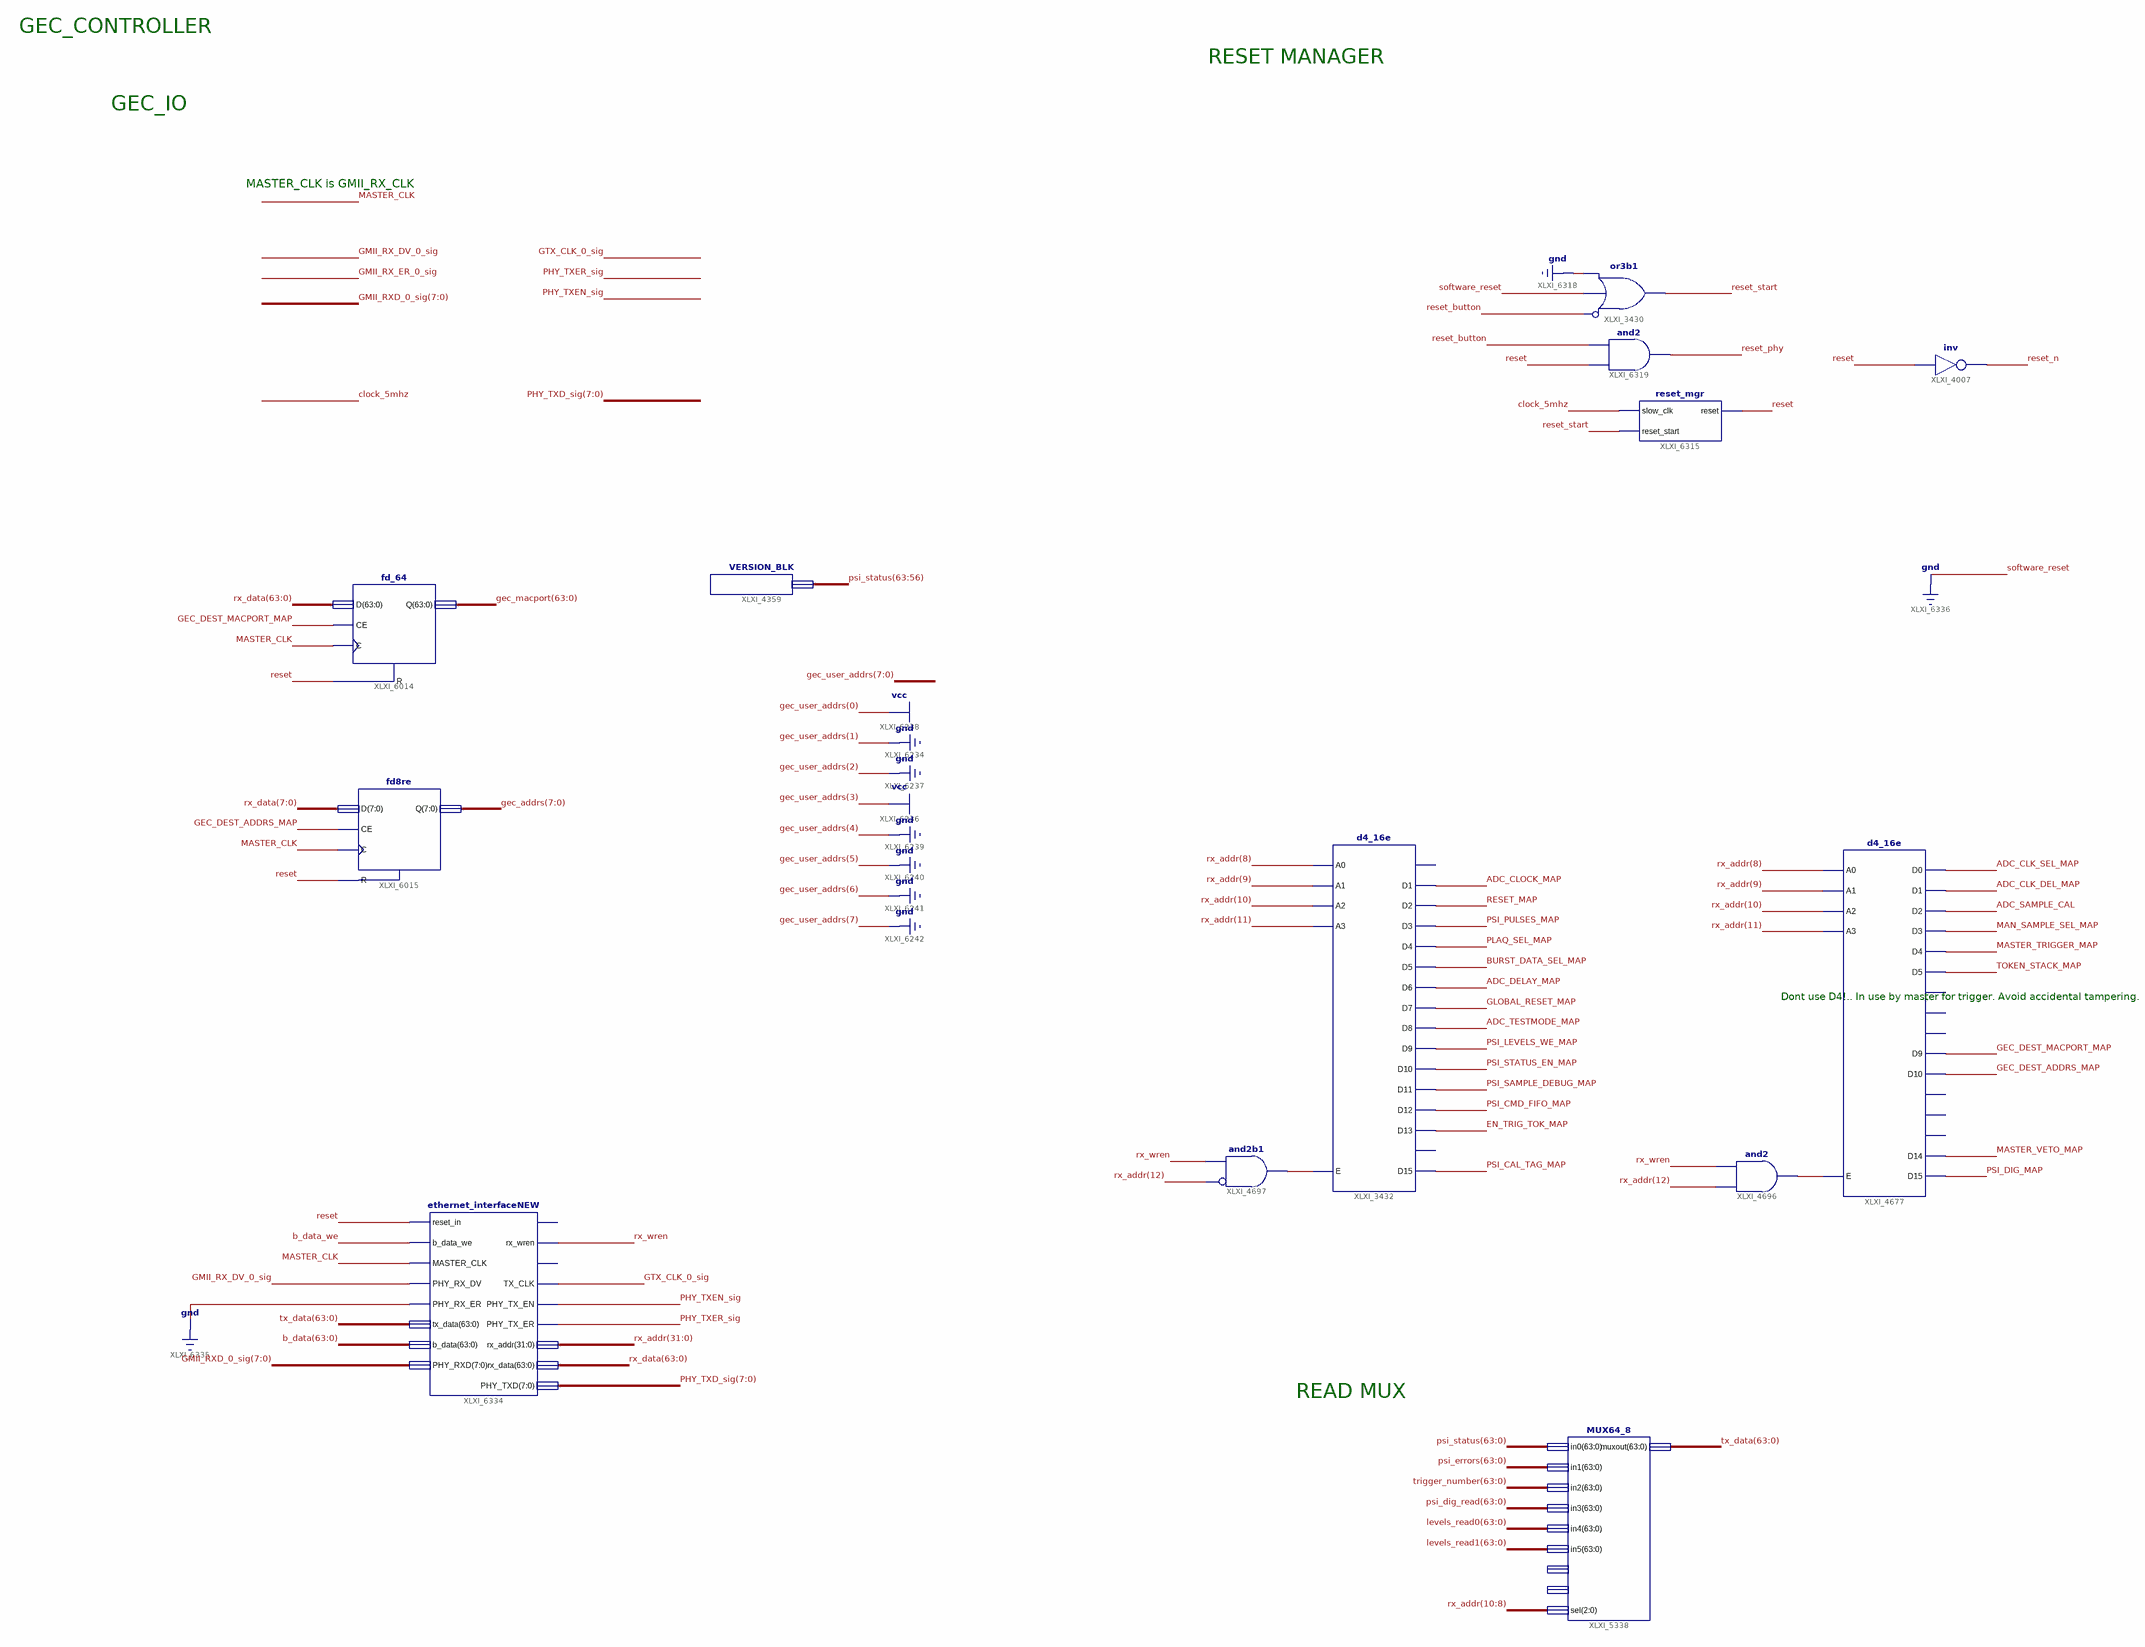
[diagram p0: schematic sheet 1]
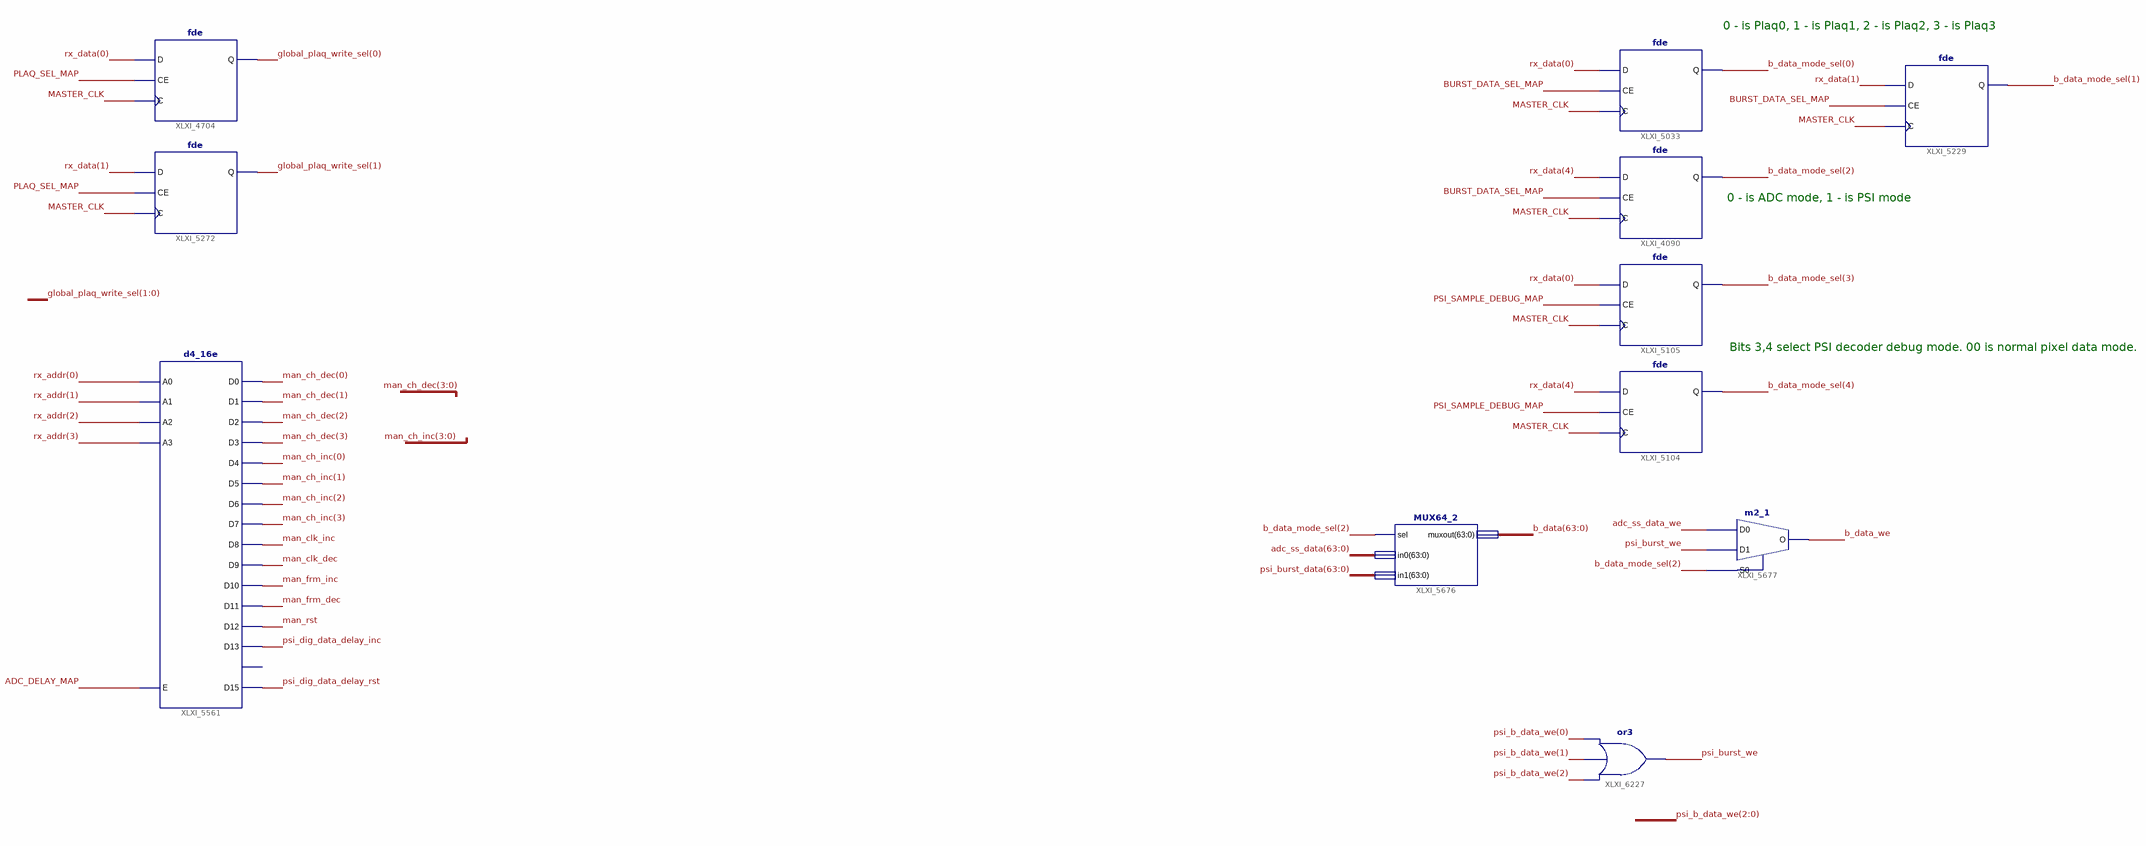
[diagram p1: schematic sheet 2]
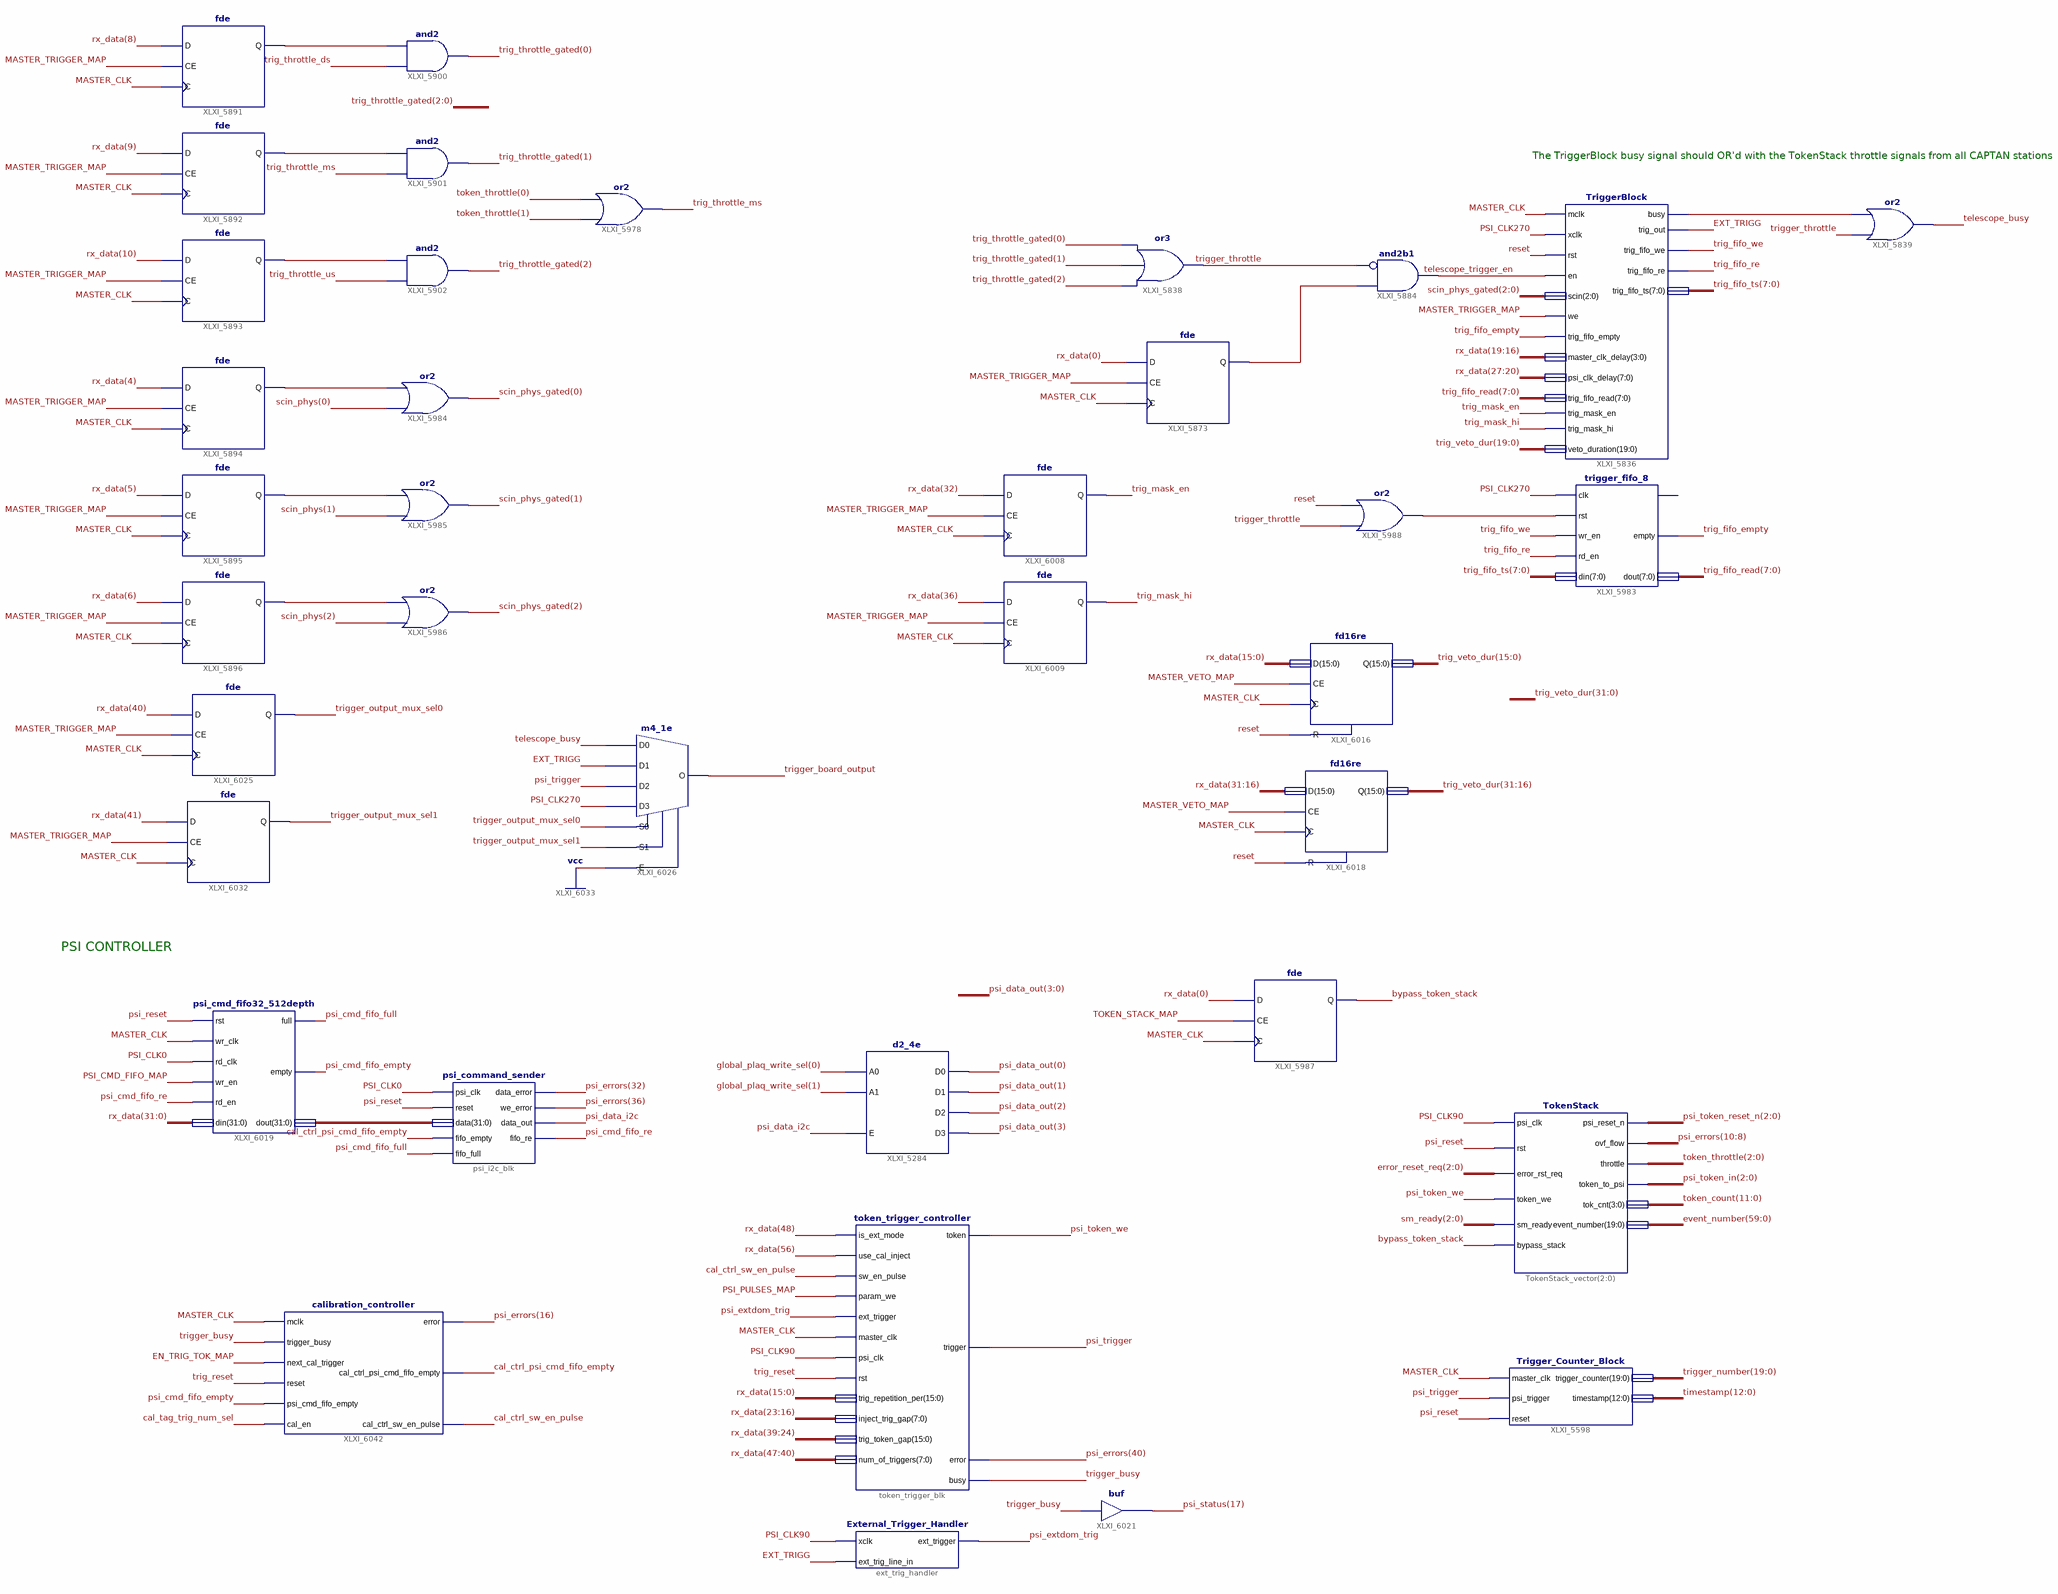
[diagram p2: schematic sheet 3]
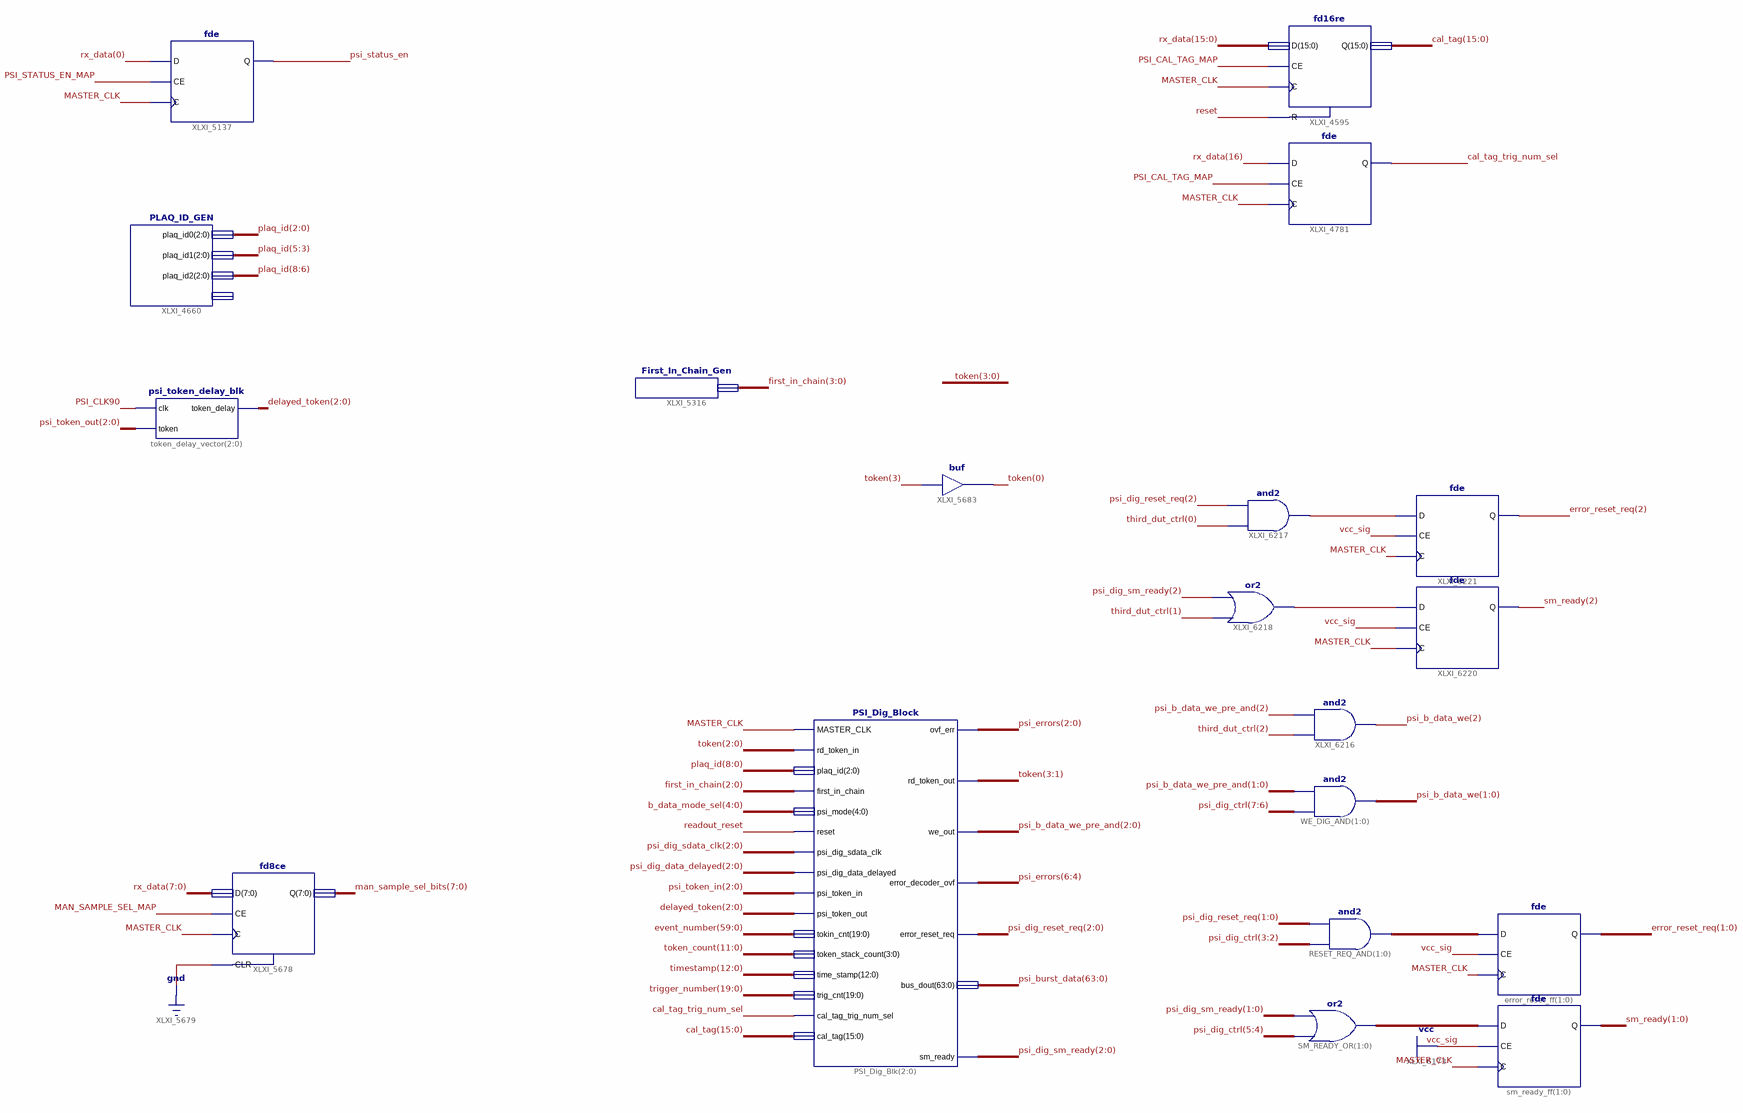
[diagram p3: schematic sheet 4]
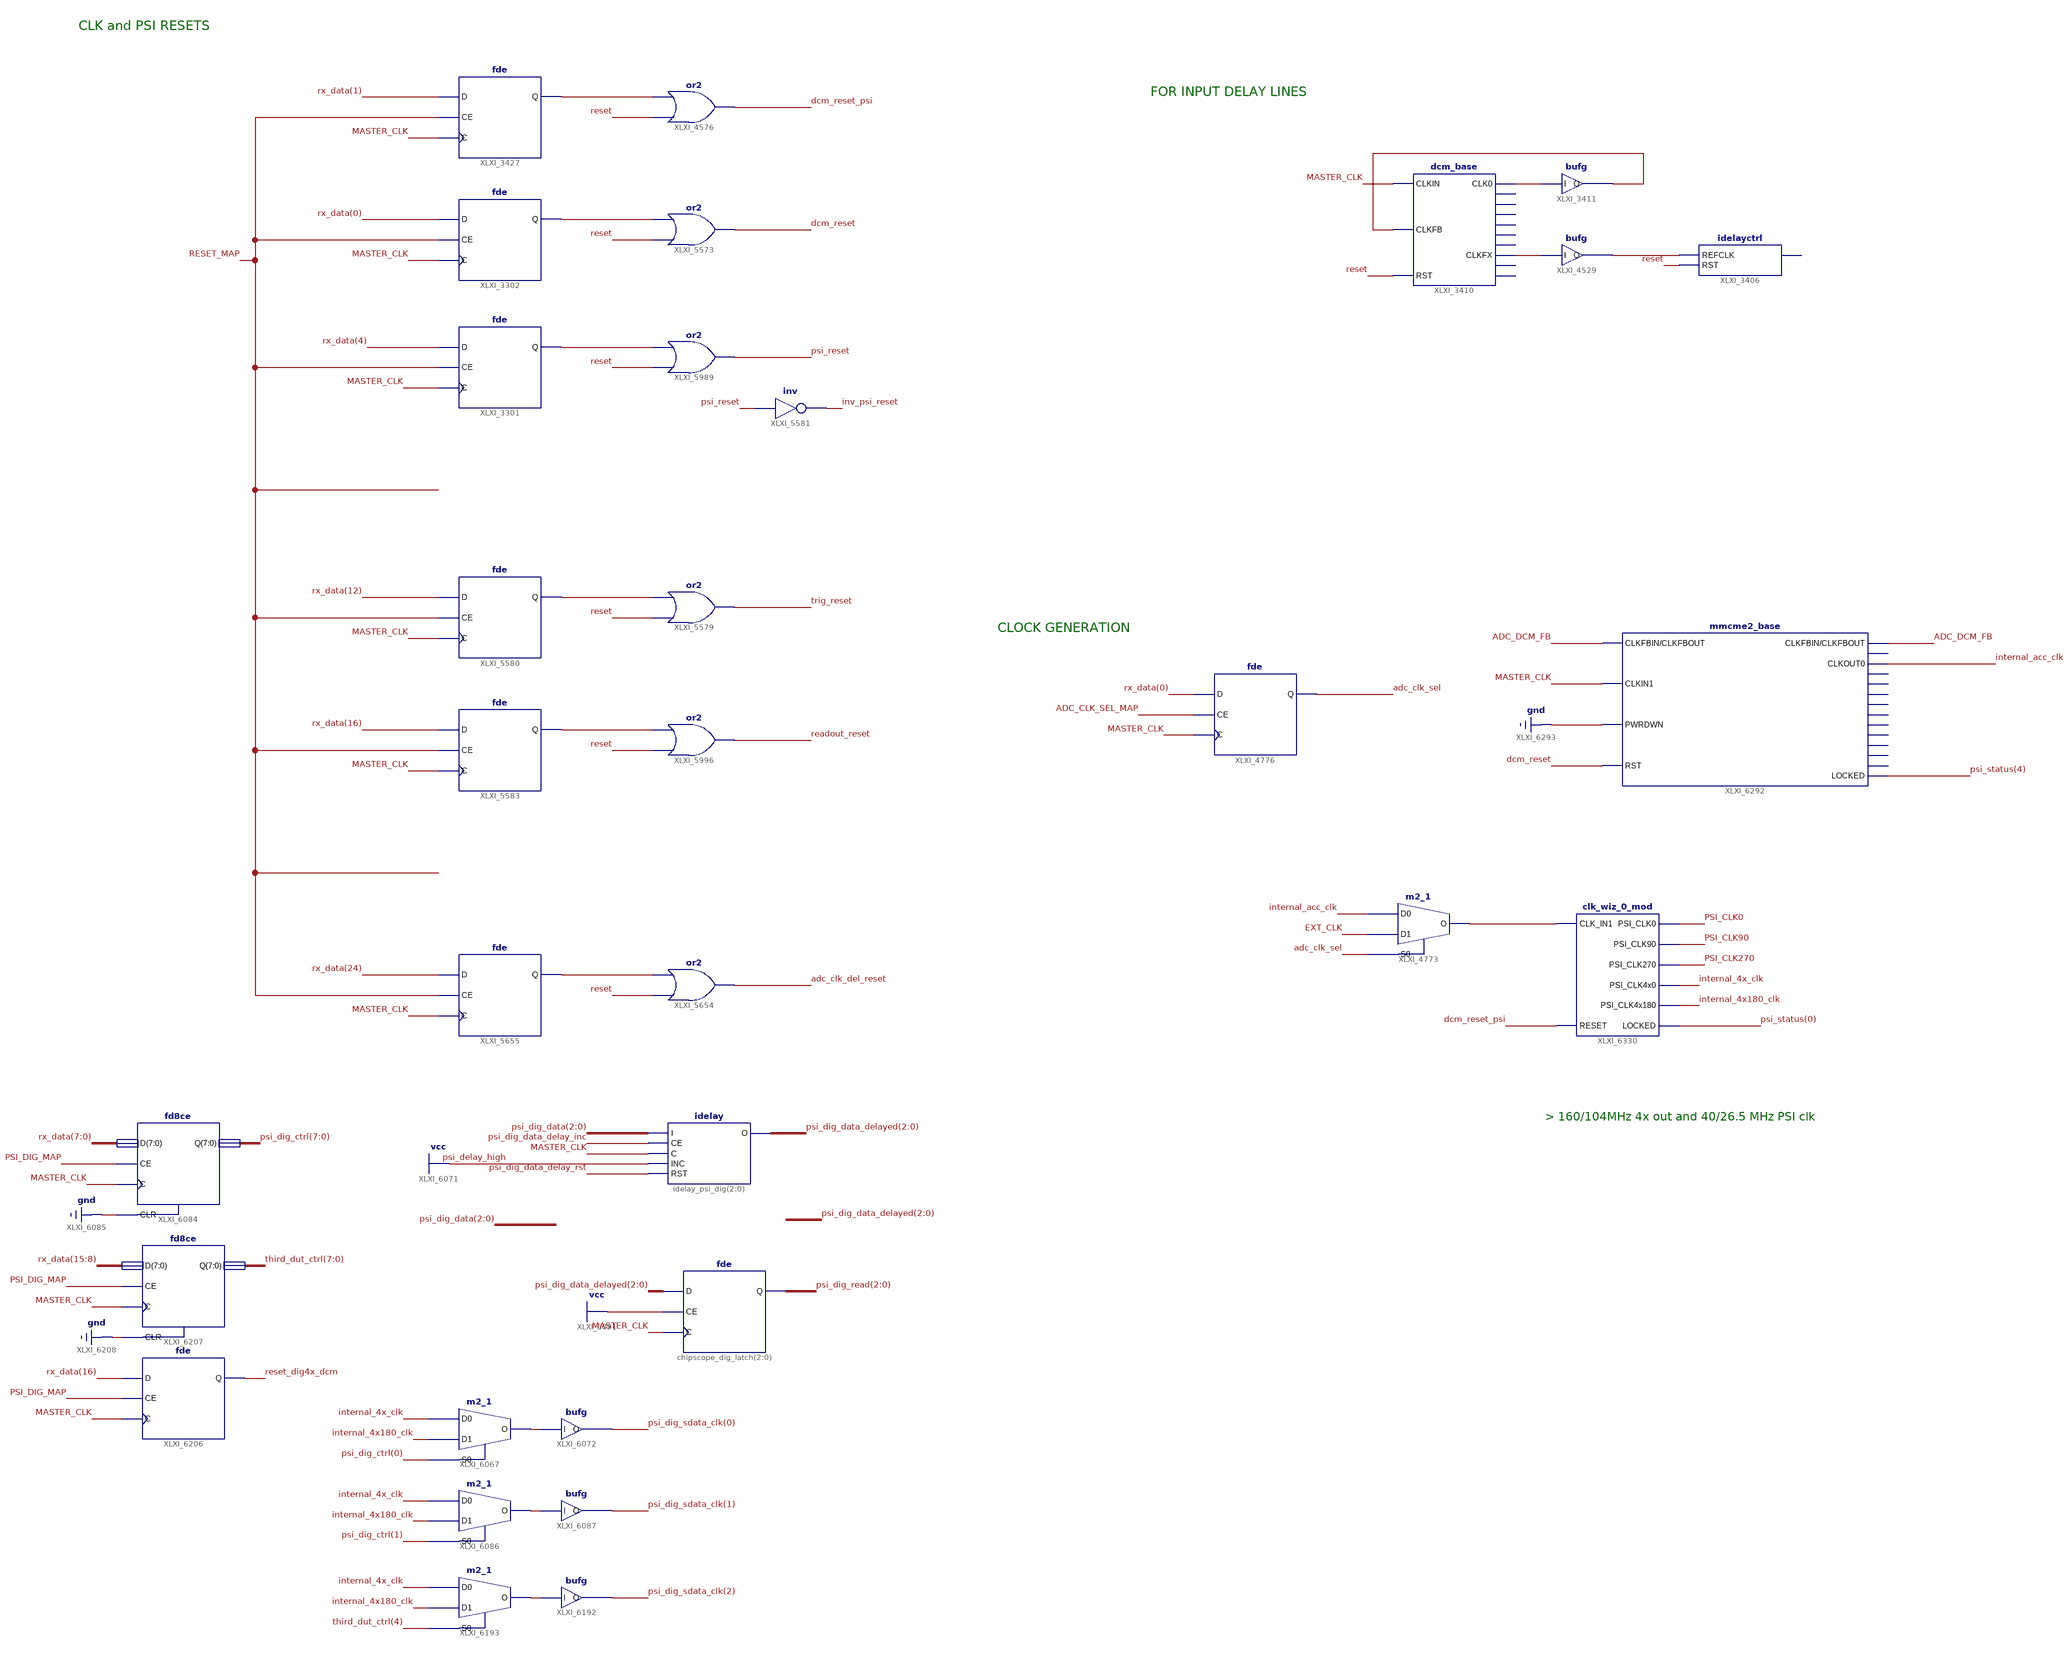
[diagram p4: schematic sheet 5]
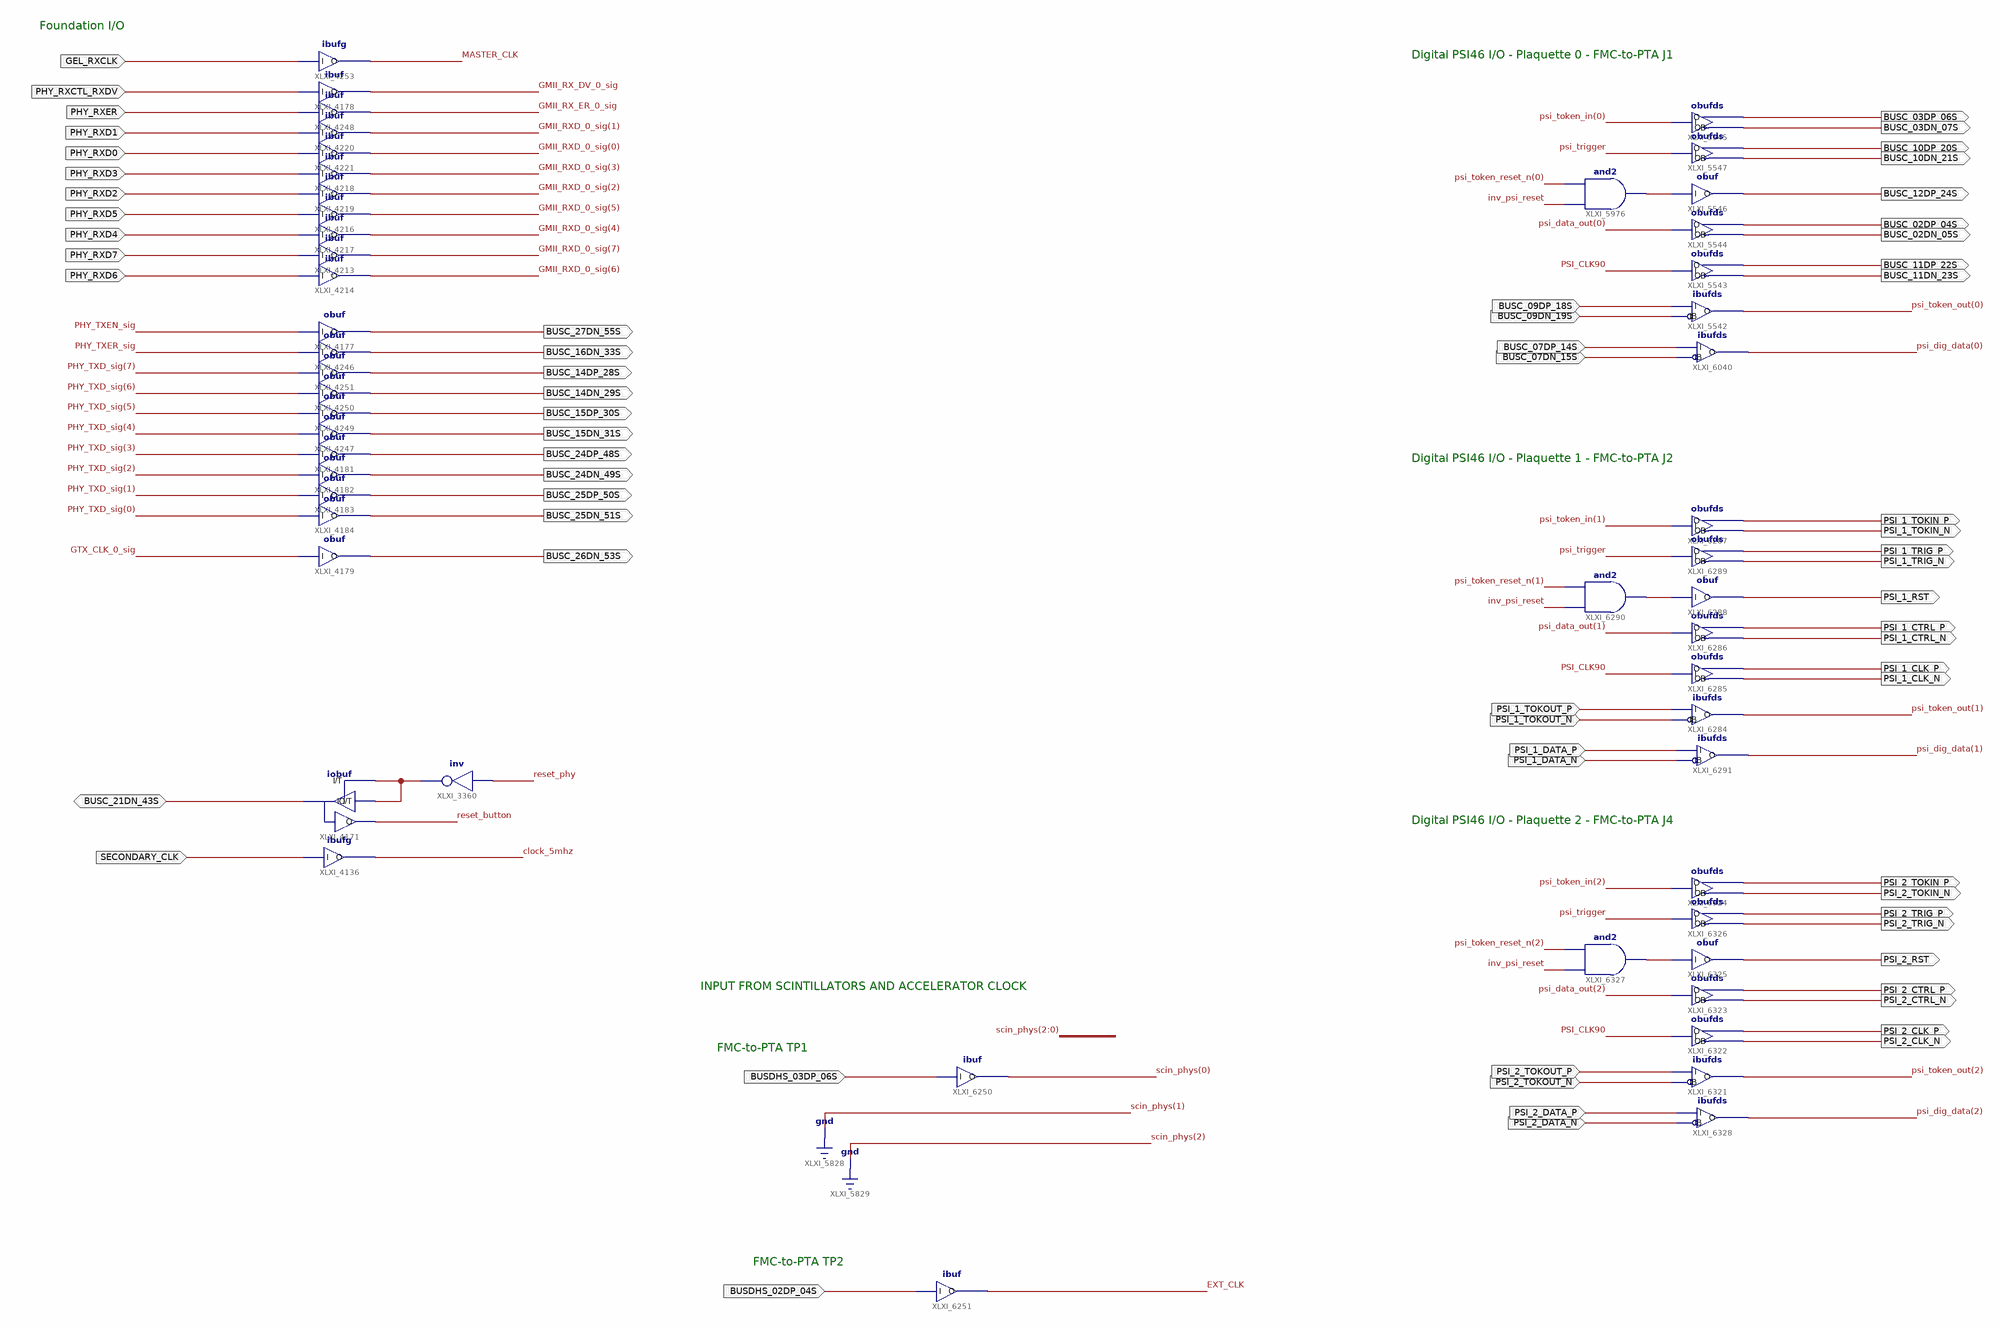
[diagram p5: schematic sheet 6]
// Xilinx ISE schematic TOP_LEVEL.sch (artix7) as structural Verilog: 163 symbols, 65 ports
module TOP_LEVEL (
  input  PHY_RXER,
  input  SECONDARY_CLK,
  input  PHY_RXD6,
  input  PHY_RXD4,
  input  PHY_RXD7,
  input  PHY_RXD5,
  input  PHY_RXD3,
  input  PHY_RXD2,
  input  PHY_RXD0,
  input  PHY_RXD1,
  input  PHY_RXCTL_RXDV,
  input  GEL_RXCLK,
  input  BUSC_09DP_18S,
  input  BUSC_09DN_19S,
  input  BUSC_07DN_15S,
  input  BUSC_07DP_14S,
  input  BUSDHS_02DP_04S,
  input  BUSDHS_03DP_06S,
  input  PSI_1_TOKOUT_P,
  input  PSI_1_TOKOUT_N,
  input  PSI_1_DATA_N,
  input  PSI_1_DATA_P,
  input  PSI_2_TOKOUT_P,
  input  PSI_2_TOKOUT_N,
  input  PSI_2_DATA_N,
  input  PSI_2_DATA_P,
  inout  BUSC_21DN_43S,
  output BUSC_25DN_51S,
  output BUSC_25DP_50S,
  output BUSC_24DN_49S,
  output BUSC_24DP_48S,
  output BUSC_15DN_31S,
  output BUSC_15DP_30S,
  output BUSC_14DN_29S,
  output BUSC_14DP_28S,
  output BUSC_16DN_33S,
  output BUSC_27DN_55S,
  output BUSC_26DN_53S,
  output BUSC_03DN_07S,
  output BUSC_02DN_05S,
  output BUSC_11DP_22S,
  output BUSC_11DN_23S,
  output BUSC_02DP_04S,
  output BUSC_12DP_24S,
  output BUSC_10DN_21S,
  output BUSC_03DP_06S,
  output BUSC_10DP_20S,
  output PSI_1_CLK_P,
  output PSI_1_CLK_N,
  output PSI_1_CTRL_P,
  output PSI_1_CTRL_N,
  output PSI_1_TOKIN_P,
  output PSI_1_TOKIN_N,
  output PSI_1_RST,
  output PSI_1_TRIG_P,
  output PSI_1_TRIG_N,
  output PSI_2_CLK_P,
  output PSI_2_CLK_N,
  output PSI_2_CTRL_P,
  output PSI_2_CTRL_N,
  output PSI_2_TOKIN_P,
  output PSI_2_TOKIN_N,
  output PSI_2_RST,
  output PSI_2_TRIG_P,
  output PSI_2_TRIG_N
);

  wire ADC_CLK_DEL_MAP, adc_clk_del_reset, adc_clk_sel, ADC_CLK_SEL_MAP, ADC_CLOCK_MAP, ADC_DCM_FB,
       ADC_DELAY_MAP, ADC_SAMPLE_CAL, adc_ss_data_we, ADC_TESTMODE_MAP, b_data_we, BURST_DATA_SEL_MAP,
       bypass_token_stack, cal_ctrl_psi_cmd_fifo_empty, cal_ctrl_sw_en_pulse, cal_tag_trig_num_sel,
       clock_5mhz, dcm_reset, dcm_reset_psi, EN_TRIG_TOK_MAP, EXT_CLK, EXT_TRIGG, GEC_DEST_ADDRS_MAP,
       GEC_DEST_MACPORT_MAP, GLOBAL_RESET_MAP, GMII_RX_DV_0_sig, GMII_RX_ER_0_sig, GTX_CLK_0_sig,
       internal_4x180_clk, internal_4x_clk, internal_acc_clk, inv_psi_reset, man_clk_dec, man_clk_inc,
       man_frm_dec, man_frm_inc, man_rst, MAN_SAMPLE_SEL_MAP, MASTER_CLK, MASTER_TRIGGER_MAP,
       MASTER_VETO_MAP, PHY_TXEN_sig, PHY_TXER_sig, PLAQ_SEL_MAP, psi_burst_we, PSI_CAL_TAG_MAP, PSI_CLK0,
       PSI_CLK90, PSI_CLK270, psi_cmd_fifo_empty, psi_cmd_fifo_full, PSI_CMD_FIFO_MAP, psi_cmd_fifo_re,
       psi_data_i2c, psi_dig_data_delay_inc, psi_dig_data_delay_rst, PSI_DIG_MAP, psi_extdom_trig,
       PSI_LEVELS_WE_MAP, PSI_PULSES_MAP, psi_reset, PSI_SAMPLE_DEBUG_MAP, psi_status_en, PSI_STATUS_EN_MAP,
       psi_token_we, psi_trigger, readout_reset, reset, reset_button, reset_dig4x_dcm, RESET_MAP, reset_n,
       reset_phy, reset_start, rx_wren, telescope_busy, telescope_trigger_en, TOKEN_STACK_MAP,
       trig_fifo_empty, trig_fifo_re, trig_fifo_we, trig_mask_en, trig_mask_hi, trig_reset, trig_throttle_ds,
       trig_throttle_ms, trig_throttle_us, trigger_board_output, trigger_busy, trigger_output_mux_sel0,
       trigger_output_mux_sel1, trigger_throttle, XLXN_12023, XLXN_12220, XLXN_12229, XLXN_12257, XLXN_12617,
       XLXN_15064, XLXN_15755, XLXN_15849, XLXN_17193, XLXN_17196, XLXN_17199, XLXN_17233, XLXN_17239,
       XLXN_17430, XLXN_17722, XLXN_17849, XLXN_17913, XLXN_17914, XLXN_17915, XLXN_17999, XLXN_18000,
       XLXN_18001, XLXN_18123, XLXN_18128, XLXN_18355, XLXN_18372, XLXN_18597, XLXN_18694, XLXN_18695,
       XLXN_18733, XLXN_18828;
  wire [0:0] scin_phys;
  wire [1:0] global_plaq_write_sel, XLXN_18540, XLXN_18546;
  wire [2:0] delayed_token, error_reset_req, psi_b_data_we, psi_b_data_we_pre_and, psi_dig_data,
       psi_dig_data_delayed, psi_dig_reset_req, psi_dig_sdata_clk, psi_dig_sm_ready, psi_token_in,
       psi_token_out, psi_token_reset_n, scin_phys_gated, sm_ready, token_throttle, trig_throttle_gated;
  wire [3:0] first_in_chain, man_ch_dec, man_ch_inc, psi_data_out, token;
  wire [4:0] b_data_mode_sel;
  wire [7:0] gec_addrs, GMII_RXD_0_sig, man_sample_sel_bits, PHY_TXD_sig, psi_dig_ctrl, third_dut_ctrl,
       trig_fifo_read, trig_fifo_ts;
  wire [8:0] plaq_id;
  wire [11:0] token_count;
  wire [12:0] timestamp;
  wire [15:0] cal_tag;
  wire [31:0] rx_addr, trig_veto_dur, XLXN_16082;
  wire [59:0] event_number;
  wire [63:0] adc_ss_data, b_data, gec_macport, levels_read0, levels_read1, psi_burst_data, psi_dig_read,
       psi_errors, psi_status, rx_data, trigger_number, tx_data;

  ibuf XLXI_4248 (.I(PHY_RXER), .O(GMII_RX_ER_0_sig));
  ibufg XLXI_4136 (.I(SECONDARY_CLK), .O(clock_5mhz));
  obuf XLXI_4181 (.I(PHY_TXD_sig[3]), .O(BUSC_24DP_48S));
  obuf XLXI_4182 (.I(PHY_TXD_sig[2]), .O(BUSC_24DN_49S));
  obuf XLXI_4183 (.I(PHY_TXD_sig[1]), .O(BUSC_25DP_50S));
  obuf XLXI_4184 (.I(PHY_TXD_sig[0]), .O(BUSC_25DN_51S));
  obuf XLXI_4247 (.I(PHY_TXD_sig[4]), .O(BUSC_15DN_31S));
  obuf XLXI_4249 (.I(PHY_TXD_sig[5]), .O(BUSC_15DP_30S));
  obuf XLXI_4250 (.I(PHY_TXD_sig[6]), .O(BUSC_14DN_29S));
  obuf XLXI_4251 (.I(PHY_TXD_sig[7]), .O(BUSC_14DP_28S));
  obuf XLXI_4246 (.I(PHY_TXER_sig), .O(BUSC_16DN_33S));
  ibuf XLXI_4213 (.I(PHY_RXD7), .O(GMII_RXD_0_sig[7]));
  ibuf XLXI_4214 (.I(PHY_RXD6), .O(GMII_RXD_0_sig[6]));
  ibuf XLXI_4216 (.I(PHY_RXD5), .O(GMII_RXD_0_sig[5]));
  ibuf XLXI_4217 (.I(PHY_RXD4), .O(GMII_RXD_0_sig[4]));
  ibuf XLXI_4218 (.I(PHY_RXD3), .O(GMII_RXD_0_sig[3]));
  ibuf XLXI_4219 (.I(PHY_RXD2), .O(GMII_RXD_0_sig[2]));
  ibuf XLXI_4220 (.I(PHY_RXD1), .O(GMII_RXD_0_sig[1]));
  ibuf XLXI_4221 (.I(PHY_RXD0), .O(GMII_RXD_0_sig[0]));
  obuf XLXI_4177 (.I(PHY_TXEN_sig), .O(BUSC_27DN_55S));
  ibuf XLXI_4178 (.I(PHY_RXCTL_RXDV), .O(GMII_RX_DV_0_sig));
  ibufg XLXI_4253 (.I(GEL_RXCLK), .O(MASTER_CLK));
  obuf XLXI_4179 (.I(GTX_CLK_0_sig), .O(BUSC_26DN_53S));
  or XLXI_3430 (reset_start, ~reset_button, 1'b0, 1'b0);  // or3b1
  d4_16e XLXI_3432 (
    .A0(rx_addr[8]), .A1(rx_addr[9]), .A2(rx_addr[10]), .A3(rx_addr[11]), .E(XLXN_12617), .D1(ADC_CLOCK_MAP),
    .D10(PSI_STATUS_EN_MAP), .D11(PSI_SAMPLE_DEBUG_MAP), .D12(PSI_CMD_FIFO_MAP), .D13(EN_TRIG_TOK_MAP),
    .D15(PSI_CAL_TAG_MAP), .D2(RESET_MAP), .D3(PSI_PULSES_MAP), .D4(PLAQ_SEL_MAP), .D5(BURST_DATA_SEL_MAP),
    .D6(ADC_DELAY_MAP), .D7(GLOBAL_RESET_MAP), .D8(ADC_TESTMODE_MAP), .D9(PSI_LEVELS_WE_MAP));  // open: D0, D14
  and XLXI_4697 (XLXN_12617, ~rx_addr[12], rx_wren);  // and2b1
  fde XLXI_3302 (.C(MASTER_CLK), .CE(RESET_MAP), .D(rx_data[0]), .Q(XLXN_17196));
  fde XLXI_3427 (.C(MASTER_CLK), .CE(RESET_MAP), .D(rx_data[1]), .Q(XLXN_17193));
  fde XLXI_3301 (.C(MASTER_CLK), .CE(RESET_MAP), .D(rx_data[4]), .Q(XLXN_17199));
  and XLXI_4696 (XLXN_15755, rx_addr[12], rx_wren);
  d4_16e XLXI_4677 (
    .A0(rx_addr[8]), .A1(rx_addr[9]), .A2(rx_addr[10]), .A3(rx_addr[11]), .E(XLXN_15755),
    .D0(ADC_CLK_SEL_MAP), .D1(ADC_CLK_DEL_MAP), .D10(GEC_DEST_ADDRS_MAP), .D14(MASTER_VETO_MAP),
    .D15(PSI_DIG_MAP), .D2(ADC_SAMPLE_CAL), .D3(MAN_SAMPLE_SEL_MAP), .D4(MASTER_TRIGGER_MAP),
    .D5(TOKEN_STACK_MAP), .D9(GEC_DEST_MACPORT_MAP));  // open: D11, D12, D13, D6, D7, D8
  fde XLXI_4090 (.C(MASTER_CLK), .CE(BURST_DATA_SEL_MAP), .D(rx_data[4]), .Q(b_data_mode_sel[2]));
  fde XLXI_5033 (.C(MASTER_CLK), .CE(BURST_DATA_SEL_MAP), .D(rx_data[0]), .Q(b_data_mode_sel[0]));
  fde XLXI_5104 (.C(MASTER_CLK), .CE(PSI_SAMPLE_DEBUG_MAP), .D(rx_data[4]), .Q(b_data_mode_sel[4]));
  fde XLXI_5105 (.C(MASTER_CLK), .CE(PSI_SAMPLE_DEBUG_MAP), .D(rx_data[0]), .Q(b_data_mode_sel[3]));
  fde XLXI_5229 (.C(MASTER_CLK), .CE(BURST_DATA_SEL_MAP), .D(rx_data[1]), .Q(b_data_mode_sel[1]));
  fde XLXI_5272 (.C(MASTER_CLK), .CE(PLAQ_SEL_MAP), .D(rx_data[1]), .Q(global_plaq_write_sel[1]));
  fde XLXI_4704 (.C(MASTER_CLK), .CE(PLAQ_SEL_MAP), .D(rx_data[0]), .Q(global_plaq_write_sel[0]));
  PLAQ_ID_GEN XLXI_4660 (.plaq_id0(plaq_id[2:0]), .plaq_id1(plaq_id[5:3]), .plaq_id2(plaq_id[8:6]));  // open: plaq_id3
  fde XLXI_5137 (.C(MASTER_CLK), .CE(PSI_STATUS_EN_MAP), .D(rx_data[0]), .Q(psi_status_en));
  psi_token_delay_blk token_delay_vector[2:0] (.clk(PSI_CLK90), .token(psi_token_out), .token_delay(delayed_token));
  First_In_Chain_Gen XLXI_5316 (.first_in_chain(first_in_chain));
  fd16re XLXI_4595 (.C(MASTER_CLK), .CE(PSI_CAL_TAG_MAP), .D(rx_data[15:0]), .R(reset), .Q(cal_tag));
  fde XLXI_4781 (.C(MASTER_CLK), .CE(PSI_CAL_TAG_MAP), .D(rx_data[16]), .Q(cal_tag_trig_num_sel));
  MUX64_8 XLXI_5338 (
    .in0(psi_status), .in1(psi_errors), .in2(trigger_number), .in3(psi_dig_read), .in4(levels_read0),
    .in5(levels_read1), .sel(rx_addr[10:8]), .muxout(tx_data));  // open: in6, in7
  d4_16e XLXI_5561 (
    .A0(rx_addr[0]), .A1(rx_addr[1]), .A2(rx_addr[2]), .A3(rx_addr[3]), .E(ADC_DELAY_MAP),
    .D0(man_ch_dec[0]), .D1(man_ch_dec[1]), .D10(man_frm_inc), .D11(man_frm_dec), .D12(man_rst),
    .D13(psi_dig_data_delay_inc), .D15(psi_dig_data_delay_rst), .D2(man_ch_dec[2]), .D3(man_ch_dec[3]),
    .D4(man_ch_inc[0]), .D5(man_ch_inc[1]), .D6(man_ch_inc[2]), .D7(man_ch_inc[3]), .D8(man_clk_inc),
    .D9(man_clk_dec));  // open: D14
  psi_command_sender psi_i2c_blk (
    .psi_clk(PSI_CLK0), .reset(psi_reset), .fifo_empty(cal_ctrl_psi_cmd_fifo_empty),
    .fifo_full(psi_cmd_fifo_full), .data(XLXN_16082), .fifo_re(psi_cmd_fifo_re), .data_error(psi_errors[32]),
    .we_error(psi_errors[36]), .data_out(psi_data_i2c));
  d2_4e XLXI_5284 (
    .A0(global_plaq_write_sel[0]), .A1(global_plaq_write_sel[1]), .E(psi_data_i2c), .D0(psi_data_out[0]),
    .D1(psi_data_out[1]), .D2(psi_data_out[2]), .D3(psi_data_out[3]));
  token_trigger_controller token_trigger_blk (
    .is_ext_mode(rx_data[48]), .use_cal_inject(rx_data[56]), .sw_en_pulse(cal_ctrl_sw_en_pulse),
    .param_we(PSI_PULSES_MAP), .ext_trigger(psi_extdom_trig), .master_clk(MASTER_CLK), .psi_clk(PSI_CLK90),
    .rst(trig_reset), .trig_repetition_per(rx_data[15:0]), .inject_trig_gap(rx_data[23:16]),
    .trig_token_gap(rx_data[39:24]), .num_of_triggers(rx_data[47:40]), .token(psi_token_we),
    .trigger(psi_trigger), .error(psi_errors[40]), .busy(trigger_busy));
  or XLXI_4576 (dcm_reset_psi, reset, XLXN_17193);
  or XLXI_5573 (dcm_reset, reset, XLXN_17196);
  or XLXI_5579 (trig_reset, reset, XLXN_17233);
  fde XLXI_5580 (.C(MASTER_CLK), .CE(RESET_MAP), .D(rx_data[12]), .Q(XLXN_17233));
  not XLXI_5581 (inv_psi_reset, psi_reset);
  fde XLXI_5583 (.C(MASTER_CLK), .CE(RESET_MAP), .D(rx_data[16]), .Q(XLXN_17239));
  or XLXI_5654 (adc_clk_del_reset, reset, XLXN_17430);
  fde XLXI_5655 (.C(MASTER_CLK), .CE(RESET_MAP), .D(rx_data[24]), .Q(XLXN_17430));
  MUX64_2 XLXI_5676 (.sel(b_data_mode_sel[2]), .in0(adc_ss_data), .in1(psi_burst_data), .muxout(b_data));
  m2_1 XLXI_5677 (.D0(adc_ss_data_we), .D1(psi_burst_we), .S0(b_data_mode_sel[2]), .O(b_data_we));
  fd8ce XLXI_5678 (.C(MASTER_CLK), .CE(MAN_SAMPLE_SEL_MAP), .CLR(1'b0), .D(rx_data[7:0]), .Q(man_sample_sel_bits));
  dcm_base #(.CLKIN_PERIOD(8), .CLKFX_MULTIPLY(8), .CLKFX_DIVIDE(5)) XLXI_3410 (
    .CLKIN(MASTER_CLK), .CLKFB(XLXN_12229), .RST(reset), .CLK0(XLXN_12220), .CLKFX(XLXN_12257));  // open: CLK90, CLK180, CLK270, CLK2X, CLK2X180, CLKDV, CLKFX180, LOCKED
  bufg XLXI_3411 (.I(XLXN_12220), .O(XLXN_12229));
  idelayctrl XLXI_3406 (.REFCLK(XLXN_15064), .RST(reset));  // open: RDY
  bufg XLXI_4529 (.I(XLXN_12257), .O(XLXN_15064));
  ibufds #(.DIFF_TERM("TRUE")) XLXI_5542 (.I(BUSC_09DP_18S), .IB(BUSC_09DN_19S), .O(psi_token_out[0]));
  obufds XLXI_5543 (.I(PSI_CLK90), .O(BUSC_11DP_22S), .OB(BUSC_11DN_23S));
  obufds XLXI_5544 (.I(psi_data_out[0]), .O(BUSC_02DP_04S), .OB(BUSC_02DN_05S));
  obufds XLXI_5545 (.I(psi_token_in[0]), .O(BUSC_03DP_06S), .OB(BUSC_03DN_07S));
  obuf XLXI_5546 (.I(XLXN_18123), .O(BUSC_12DP_24S));
  obufds XLXI_5547 (.I(psi_trigger), .O(BUSC_10DP_20S), .OB(BUSC_10DN_21S));
  fde XLXI_4776 (.C(MASTER_CLK), .CE(ADC_CLK_SEL_MAP), .D(rx_data[0]), .Q(adc_clk_sel));
  External_Trigger_Handler ext_trig_handler (
    .xclk(PSI_CLK90), .ext_trig_line_in(EXT_TRIGG), .ext_trigger(psi_extdom_trig));
  TokenStack TokenStack_vector[2:0] (
    .psi_clk(PSI_CLK90), .rst(psi_reset), .error_rst_req(error_reset_req), .token_we(psi_token_we),
    .sm_ready(sm_ready), .bypass_stack(bypass_token_stack), .psi_reset_n(psi_token_reset_n),
    .ovf_flow(psi_errors[10:8]), .throttle(token_throttle), .token_to_psi(psi_token_in),
    .tok_cnt(token_count), .event_number(event_number));
  Trigger_Counter_Block XLXI_5598 (
    .master_clk(MASTER_CLK), .psi_trigger(psi_trigger), .reset(psi_reset),
    .trigger_counter(trigger_number[19:0]), .timestamp(timestamp));
  and XLXI_5976 (XLXN_18123, inv_psi_reset, psi_token_reset_n[0]);
  fde XLXI_5987 (.C(MASTER_CLK), .CE(TOKEN_STACK_MAP), .D(rx_data[0]), .Q(bypass_token_stack));
  or XLXI_5989 (psi_reset, reset, XLXN_17199);
  or XLXI_5996 (readout_reset, reset, XLXN_17239);
  VERSION_BLK XLXI_4359 (.version(psi_status[63:56]));
  fd_64 XLXI_6014 (.Q(gec_macport), .CE(GEC_DEST_MACPORT_MAP), .D(rx_data), .C(MASTER_CLK), .R(reset));
  fd8re XLXI_6015 (.C(MASTER_CLK), .CE(GEC_DEST_ADDRS_MAP), .D(rx_data[7:0]), .R(reset), .Q(gec_addrs));
  psi_cmd_fifo32_512depth XLXI_6019 (
    .rst(psi_reset), .wr_clk(MASTER_CLK), .rd_clk(PSI_CLK0), .wr_en(PSI_CMD_FIFO_MAP),
    .rd_en(psi_cmd_fifo_re), .din(rx_data[31:0]), .full(psi_cmd_fifo_full), .empty(psi_cmd_fifo_empty),
    .dout(XLXN_16082));
  buf XLXI_6021 (psi_status[17], trigger_busy);
  calibration_controller XLXI_6042 (
    .mclk(MASTER_CLK), .trigger_busy(trigger_busy), .next_cal_trigger(EN_TRIG_TOK_MAP), .reset(trig_reset),
    .psi_cmd_fifo_empty(psi_cmd_fifo_empty), .cal_en(cal_tag_trig_num_sel), .error(psi_errors[16]),
    .cal_ctrl_psi_cmd_fifo_empty(cal_ctrl_psi_cmd_fifo_empty), .cal_ctrl_sw_en_pulse(cal_ctrl_sw_en_pulse));
  buf XLXI_5683 (token[0], token[3]);
  idelay #(.IOBDELAY_TYPE("VARIABLE")) idelay_psi_dig[2:0] (
    .I(psi_dig_data), .CE(psi_dig_data_delay_inc), .C(MASTER_CLK), .INC(1'b1), .RST(psi_dig_data_delay_rst),
    .O(psi_dig_data_delayed));
  fde chipscope_dig_latch[2:0] (.C(MASTER_CLK), .CE(1'b1), .D(psi_dig_data_delayed), .Q(psi_dig_read[2:0]));
  PSI_Dig_Block PSI_Dig_Blk[2:0] (
    .MASTER_CLK(MASTER_CLK), .rd_token_in(token[2:0]), .plaq_id(plaq_id),
    .first_in_chain(first_in_chain[2:0]), .psi_mode(b_data_mode_sel), .reset(readout_reset),
    .psi_dig_sdata_clk(psi_dig_sdata_clk), .psi_dig_data_delayed(psi_dig_data_delayed),
    .psi_token_in(psi_token_in), .psi_token_out(delayed_token), .tokin_cnt(event_number),
    .token_stack_count(token_count), .time_stamp(timestamp), .trig_cnt(trigger_number[19:0]),
    .cal_tag_trig_num_sel(cal_tag_trig_num_sel), .cal_tag(cal_tag), .bus_dout(psi_burst_data),
    .ovf_err(psi_errors[2:0]), .rd_token_out(token[3:1]), .we_out(psi_b_data_we_pre_and),
    .error_decoder_ovf(psi_errors[6:4]), .error_reset_req(psi_dig_reset_req), .sm_ready(psi_dig_sm_ready));
  assign psi_b_data_we[1:0] = psi_dig_ctrl[7:6] & psi_b_data_we_pre_and[1:0];  // and2 WE_DIG_AND[1..0], 2 bits wide
  assign XLXN_18546 = psi_dig_ctrl[3:2] & psi_dig_reset_req[1:0];  // and2 RESET_REQ_AND[1..0], 2 bits wide
  assign XLXN_18540 = psi_dig_ctrl[5:4] | psi_dig_sm_ready[1:0];  // or2 SM_READY_OR[1..0], 2 bits wide
  ibufds #(.DIFF_TERM("TRUE")) XLXI_6040 (.I(BUSC_07DP_14S), .IB(BUSC_07DN_15S), .O(psi_dig_data[0]));
  iobuf XLXI_4171 (.I(XLXN_12023), .IO(BUSC_21DN_43S), .O(reset_button), .T(XLXN_12023));
  not XLXI_3360 (XLXN_12023, reset_phy);
  fde sm_ready_ff[1:0] (.C(MASTER_CLK), .CE(1'b1), .D(XLXN_18540), .Q(sm_ready[1:0]));
  fde error_reset_ff[1:0] (.C(MASTER_CLK), .CE(1'b1), .D(XLXN_18546), .Q(error_reset_req[1:0]));
  m2_1 XLXI_6067 (.D0(internal_4x_clk), .D1(internal_4x180_clk), .S0(psi_dig_ctrl[0]), .O(XLXN_18355));
  bufg XLXI_6072 (.I(XLXN_18355), .O(psi_dig_sdata_clk[0]));
  bufg XLXI_6087 (.I(XLXN_18372), .O(psi_dig_sdata_clk[1]));
  m2_1 XLXI_6086 (.D0(internal_4x_clk), .D1(internal_4x180_clk), .S0(psi_dig_ctrl[1]), .O(XLXN_18372));
  bufg XLXI_6192 (.I(XLXN_18597), .O(psi_dig_sdata_clk[2]));
  m2_1 XLXI_6193 (.D0(internal_4x_clk), .D1(internal_4x180_clk), .S0(third_dut_ctrl[4]), .O(XLXN_18597));
  fd8ce XLXI_6084 (.C(MASTER_CLK), .CE(PSI_DIG_MAP), .CLR(1'b0), .D(rx_data[7:0]), .Q(psi_dig_ctrl));
  fde XLXI_6206 (.C(MASTER_CLK), .CE(PSI_DIG_MAP), .D(rx_data[16]), .Q(reset_dig4x_dcm));
  fd8ce XLXI_6207 (.C(MASTER_CLK), .CE(PSI_DIG_MAP), .CLR(1'b0), .D(rx_data[15:8]), .Q(third_dut_ctrl));
  and XLXI_6216 (psi_b_data_we[2], third_dut_ctrl[2], psi_b_data_we_pre_and[2]);
  and XLXI_6217 (XLXN_18694, third_dut_ctrl[0], psi_dig_reset_req[2]);
  or XLXI_6218 (XLXN_18695, third_dut_ctrl[1], psi_dig_sm_ready[2]);
  fde XLXI_6220 (.C(MASTER_CLK), .CE(1'b1), .D(XLXN_18695), .Q(sm_ready[2]));
  fde XLXI_6221 (.C(MASTER_CLK), .CE(1'b1), .D(XLXN_18694), .Q(error_reset_req[2]));
  or XLXI_6227 (psi_burst_we, psi_b_data_we[2], psi_b_data_we[1], psi_b_data_we[0]);
  ibuf XLXI_6250 (.I(BUSDHS_03DP_06S), .O(scin_phys[0]));
  ibuf XLXI_6251 (.I(BUSDHS_02DP_04S), .O(EXT_CLK));
  fde XLXI_5873 (.C(MASTER_CLK), .CE(MASTER_TRIGGER_MAP), .D(rx_data[0]), .Q(XLXN_17849));
  or XLXI_5838 (trigger_throttle, trig_throttle_gated[2], trig_throttle_gated[1], trig_throttle_gated[0]);
  and XLXI_5884 (telescope_trigger_en, ~trigger_throttle, XLXN_17849);  // and2b1
  fde XLXI_5892 (.C(MASTER_CLK), .CE(MASTER_TRIGGER_MAP), .D(rx_data[9]), .Q(XLXN_17914));
  fde XLXI_5893 (.C(MASTER_CLK), .CE(MASTER_TRIGGER_MAP), .D(rx_data[10]), .Q(XLXN_17915));
  fde XLXI_5891 (.C(MASTER_CLK), .CE(MASTER_TRIGGER_MAP), .D(rx_data[8]), .Q(XLXN_17913));
  and XLXI_5900 (trig_throttle_gated[0], trig_throttle_ds, XLXN_17913);
  and XLXI_5901 (trig_throttle_gated[1], trig_throttle_ms, XLXN_17914);
  and XLXI_5902 (trig_throttle_gated[2], trig_throttle_us, XLXN_17915);
  fde XLXI_5895 (.C(MASTER_CLK), .CE(MASTER_TRIGGER_MAP), .D(rx_data[5]), .Q(XLXN_18000));
  fde XLXI_5896 (.C(MASTER_CLK), .CE(MASTER_TRIGGER_MAP), .D(rx_data[6]), .Q(XLXN_18001));
  fde XLXI_5894 (.C(MASTER_CLK), .CE(MASTER_TRIGGER_MAP), .D(rx_data[4]), .Q(XLXN_17999));
  or XLXI_5978 (trig_throttle_ms, token_throttle[1], token_throttle[0]);
  TriggerBlock XLXI_5836 (
    .mclk(MASTER_CLK), .xclk(PSI_CLK270), .rst(reset), .en(telescope_trigger_en), .we(MASTER_TRIGGER_MAP),
    .trig_fifo_empty(trig_fifo_empty), .trig_mask_en(trig_mask_en), .trig_mask_hi(trig_mask_hi),
    .scin(scin_phys_gated), .master_clk_delay(rx_data[19:16]), .psi_clk_delay(rx_data[27:20]),
    .trig_fifo_read(trig_fifo_read), .trig_fifo_we(trig_fifo_we), .trig_fifo_re(trig_fifo_re),
    .busy(XLXN_17722), .trig_out(EXT_TRIGG), .trig_fifo_ts(trig_fifo_ts), .veto_duration(trig_veto_dur[19:0]));
  or XLXI_5839 (telescope_busy, trigger_throttle, XLXN_17722);
  or XLXI_5984 (scin_phys_gated[0], scin_phys[0], XLXN_17999);
  or XLXI_5985 (scin_phys_gated[1], 1'b0, XLXN_18000);
  or XLXI_5986 (scin_phys_gated[2], 1'b0, XLXN_18001);
  or XLXI_5988 (XLXN_18128, trigger_throttle, reset);
  trigger_fifo_8 XLXI_5983 (
    .clk(PSI_CLK270), .rst(XLXN_18128), .wr_en(trig_fifo_we), .rd_en(trig_fifo_re), .din(trig_fifo_ts),
    .empty(trig_fifo_empty), .dout(trig_fifo_read));  // open: full
  fde XLXI_6008 (.C(MASTER_CLK), .CE(MASTER_TRIGGER_MAP), .D(rx_data[32]), .Q(trig_mask_en));
  fde XLXI_6009 (.C(MASTER_CLK), .CE(MASTER_TRIGGER_MAP), .D(rx_data[36]), .Q(trig_mask_hi));
  fd16re XLXI_6016 (.C(MASTER_CLK), .CE(MASTER_VETO_MAP), .D(rx_data[15:0]), .R(reset), .Q(trig_veto_dur[15:0]));
  fd16re XLXI_6018 (.C(MASTER_CLK), .CE(MASTER_VETO_MAP), .D(rx_data[31:16]), .R(reset), .Q(trig_veto_dur[31:16]));
  m4_1e XLXI_6026 (
    .D0(telescope_busy), .D1(EXT_TRIGG), .D2(psi_trigger), .D3(PSI_CLK270), .E(1'b1),
    .S0(trigger_output_mux_sel0), .S1(trigger_output_mux_sel1), .O(trigger_board_output));
  fde XLXI_6025 (.C(MASTER_CLK), .CE(MASTER_TRIGGER_MAP), .D(rx_data[40]), .Q(trigger_output_mux_sel0));
  fde XLXI_6032 (.C(MASTER_CLK), .CE(MASTER_TRIGGER_MAP), .D(rx_data[41]), .Q(trigger_output_mux_sel1));
  ibufds #(.DIFF_TERM("TRUE")) XLXI_6284 (.I(PSI_1_TOKOUT_P), .IB(PSI_1_TOKOUT_N), .O(psi_token_out[1]));
  obufds XLXI_6285 (.I(PSI_CLK90), .O(PSI_1_CLK_P), .OB(PSI_1_CLK_N));
  obufds XLXI_6286 (.I(psi_data_out[1]), .O(PSI_1_CTRL_P), .OB(PSI_1_CTRL_N));
  obufds XLXI_6287 (.I(psi_token_in[1]), .O(PSI_1_TOKIN_P), .OB(PSI_1_TOKIN_N));
  obuf XLXI_6288 (.I(XLXN_18733), .O(PSI_1_RST));
  obufds XLXI_6289 (.I(psi_trigger), .O(PSI_1_TRIG_P), .OB(PSI_1_TRIG_N));
  and XLXI_6290 (XLXN_18733, inv_psi_reset, psi_token_reset_n[1]);
  ibufds #(.DIFF_TERM("TRUE")) XLXI_6291 (.I(PSI_1_DATA_P), .IB(PSI_1_DATA_N), .O(psi_dig_data[1]));
  mmcme2_base #(.CLKOUT0_DIVIDE_F(28), .CLKFBOUT_MULT_F(6), .CLKIN1_PERIOD(8)) XLXI_6292 (
    .CLKFBIN(ADC_DCM_FB), .CLKIN1(MASTER_CLK), .PWRDWN(1'b0), .RST(dcm_reset), .CLKFBOUT(ADC_DCM_FB),
    .CLKOUT0(internal_acc_clk), .LOCKED(psi_status[4]));  // open: CLKFBOUTB, CLKOUT0B, CLKOUT1, CLKOUT1B, CLKOUT2, CLKOUT2B, CLKOUT3, CLKOUT3B, CLKOUT4, CLKOUT5, CLKOUT6
  m2_1 XLXI_4773 (.D0(internal_acc_clk), .D1(EXT_CLK), .S0(adc_clk_sel), .O(XLXN_15849));
  reset_mgr XLXI_6315 (.slow_clk(clock_5mhz), .reset_start(reset_start), .reset(reset));
  not XLXI_4007 (reset_n, reset);
  and XLXI_6319 (reset_phy, reset, reset_button);
  ibufds #(.DIFF_TERM("TRUE")) XLXI_6321 (.I(PSI_2_TOKOUT_P), .IB(PSI_2_TOKOUT_N), .O(psi_token_out[2]));
  obufds XLXI_6322 (.I(PSI_CLK90), .O(PSI_2_CLK_P), .OB(PSI_2_CLK_N));
  obufds XLXI_6323 (.I(psi_data_out[2]), .O(PSI_2_CTRL_P), .OB(PSI_2_CTRL_N));
  obufds XLXI_6324 (.I(psi_token_in[2]), .O(PSI_2_TOKIN_P), .OB(PSI_2_TOKIN_N));
  obuf XLXI_6325 (.I(XLXN_18828), .O(PSI_2_RST));
  obufds XLXI_6326 (.I(psi_trigger), .O(PSI_2_TRIG_P), .OB(PSI_2_TRIG_N));
  and XLXI_6327 (XLXN_18828, inv_psi_reset, psi_token_reset_n[2]);
  ibufds #(.DIFF_TERM("TRUE")) XLXI_6328 (.I(PSI_2_DATA_P), .IB(PSI_2_DATA_N), .O(psi_dig_data[2]));
  clk_wiz_0_mod XLXI_6330 (
    .CLK_IN1(XLXN_15849), .RESET(dcm_reset_psi), .PSI_CLK0(PSI_CLK0), .PSI_CLK90(PSI_CLK90),
    .PSI_CLK270(PSI_CLK270), .PSI_CLK4x0(internal_4x_clk), .PSI_CLK4x180(internal_4x180_clk),
    .LOCKED(psi_status[0]));
  ethernet_interfaceNEW XLXI_6334 (
    .reset_in(reset), .b_data_we(b_data_we), .MASTER_CLK(MASTER_CLK), .PHY_RX_DV(GMII_RX_DV_0_sig),
    .PHY_RX_ER(1'b0), .tx_data(tx_data), .b_data(b_data), .PHY_RXD(GMII_RXD_0_sig), .rx_wren(rx_wren),
    .TX_CLK(GTX_CLK_0_sig), .PHY_TX_EN(PHY_TXEN_sig), .PHY_TX_ER(PHY_TXER_sig), .rx_addr(rx_addr),
    .rx_data(rx_data), .PHY_TXD(PHY_TXD_sig));  // open: reset_out, b_enable

  // Notes on the sheet:
  //   GEC_CONTROLLER
  //   RESET MANAGER
  //   GEC_IO
  //   MASTER_CLK is GMII_RX_CLK
  //   Dont use D4!.. In use by master for trigger. Avoid accidental tampering.
  //   READ MUX
  //   0 - is Plaq0, 1 - is Plaq1, 2 - is Plaq2, 3 - is Plaq3
  //   0 - is ADC mode, 1 - is PSI mode
  //   Bits 3,4 select PSI decoder debug mode. 00 is normal pixel data mode.
  //   The TriggerBlock busy signal should OR'd with the TokenStack throttle signals from all CAPTAN stations
  //   PSI CONTROLLER
  //   CLK and PSI RESETS
  //   FOR INPUT DELAY LINES
  //   CLOCK GENERATION
  //   > 160/104MHz 4x out and 40/26.5 MHz PSI clk
  //   Foundation I/O
  //   Digital PSI46 I/O - Plaquette 0 - FMC-to-PTA J1
  //   Digital PSI46 I/O - Plaquette 1 - FMC-to-PTA J2
  //   Digital PSI46 I/O - Plaquette 2 - FMC-to-PTA J4
  //   INPUT FROM SCINTILLATORS AND ACCELERATOR CLOCK
  //   FMC-to-PTA TP1
  //   FMC-to-PTA TP2
endmodule
